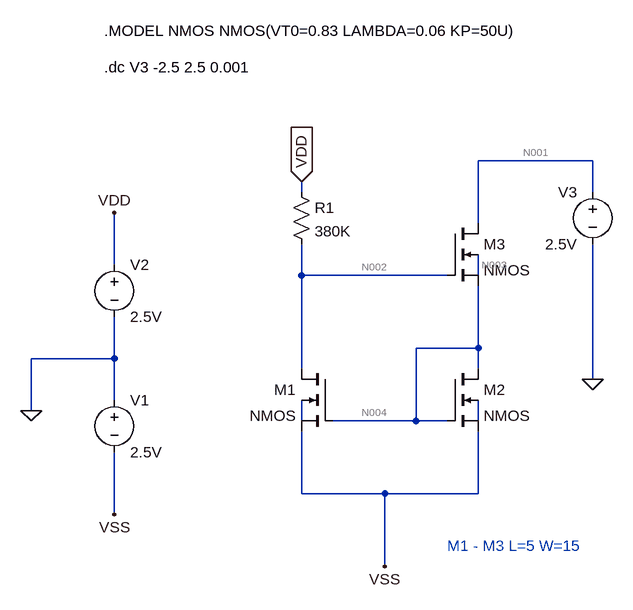
[diagram p0: schematic WilsonCM.asc]
WilsonCM.asc, the LTspice schematic file:
Version 4
SHEET 1 1412 680
WIRE 544 -144 368 -144
WIRE 96 -96 96 -112
WIRE 544 -96 544 -144
WIRE 368 -48 368 -144
WIRE -192 16 -192 -64
WIRE 96 32 96 -16
WIRE 320 32 96 32
WIRE 368 32 368 0
WIRE 368 144 368 48
WIRE 368 144 272 144
WIRE -192 160 -192 96
WIRE -192 160 -320 160
WIRE 96 176 96 32
WIRE 368 176 368 144
WIRE 544 192 544 -16
WIRE -192 224 -192 160
WIRE -320 240 -320 160
WIRE 96 256 96 224
WIRE 272 256 272 144
WIRE 272 256 144 256
WIRE 320 256 272 256
WIRE 368 256 368 224
WIRE 96 368 96 272
WIRE 224 368 96 368
WIRE 368 368 368 272
WIRE 368 368 224 368
WIRE -192 400 -192 304
WIRE 224 480 224 368
FLAG -320 240 0
FLAG 544 192 0
FLAG -192 -64 VDD
FLAG -192 400 VSS
FLAG 224 480 VSS
FLAG 96 -112 VDD
IOPIN 96 -112 In
SYMBOL nmos4 144 176 M0
SYMATTR InstName M1
SYMATTR Value2 l=5 w=15
SYMBOL nmos4 320 176 R0
SYMATTR InstName M2
SYMATTR Value2 l=5 w=15
SYMBOL voltage -192 208 R0
WINDOW 123 0 0 Left 2
WINDOW 39 0 0 Left 2
SYMATTR InstName V1
SYMATTR Value 2.5V
SYMBOL voltage -192 0 R0
WINDOW 123 0 0 Left 2
WINDOW 39 0 0 Left 2
SYMATTR InstName V2
SYMATTR Value 2.5V
SYMBOL voltage 544 -112 M0
WINDOW 123 0 0 Left 2
WINDOW 39 0 0 Left 2
SYMATTR InstName V3
SYMATTR Value 2.5V
SYMBOL nmos4 320 -48 R0
SYMATTR InstName M3
SYMATTR Value2 l=5 w=15
SYMBOL res 80 -112 R0
SYMATTR InstName R1
SYMATTR Value 380K
TEXT -208 -344 Left 2 !.MODEL NMOS NMOS(VT0=0.83 LAMBDA=0.06 KP=50U)
TEXT -208 -288 Left 2 !.dc V3 -2.5 2.5 0.001
TEXT 320 448 Left 2 ;M1 - M3 L=5 W=15

The netlist it stands for:
* WilsonCM.asc
M1 N002 N004 VSS N005 NMOS l=5 w=15
M2 N004 N004 VSS N006 NMOS l=5 w=15
V1 0 VSS 2.5V
V2 VDD 0 2.5V
V3 N001 0 2.5V
M3 N001 N002 N004 N003 NMOS l=5 w=15
R1 VDD N002 380K
.model NMOS NMOS
.model PMOS PMOS
.lib standard.mos
.MODEL NMOS NMOS(VT0=0.83 LAMBDA=0.06 KP=50U)
.dc V3 -2.5 2.5 0.001
* M1 - M3 L=5 W=15
.backanno
.end

* Results of the author's LTspice run, read from the files saved beside the schematic
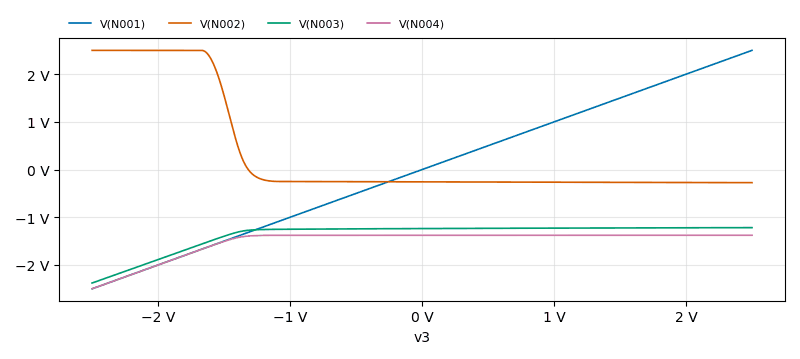
[diagram p1: DC transfer characteristic of WilsonCM.asc, plotted from the saved traces]
* DC transfer characteristic, 1 run:
*   V(N001): -2.5 V at v3=-2.5 V, 2.5 V at v3=2.5 V, min -2.5 V, max 2.5 V
*   V(N002): 2.5 V at v3=-2.5 V, -274.3 mV at v3=2.5 V, min -274.3 mV, max 2.5 V
*   V(N003): -2.379 V at v3=-2.5 V, -1.217 V at v3=2.5 V, min -2.379 V, max -1.217 V
*   V(N004): -2.5 V at v3=-2.5 V, -1.377 V at v3=2.5 V, min -2.5 V, max -1.377 V